# EAGLE schematic atmega2560_3_3v_8mhz (EAGLE 6.1)
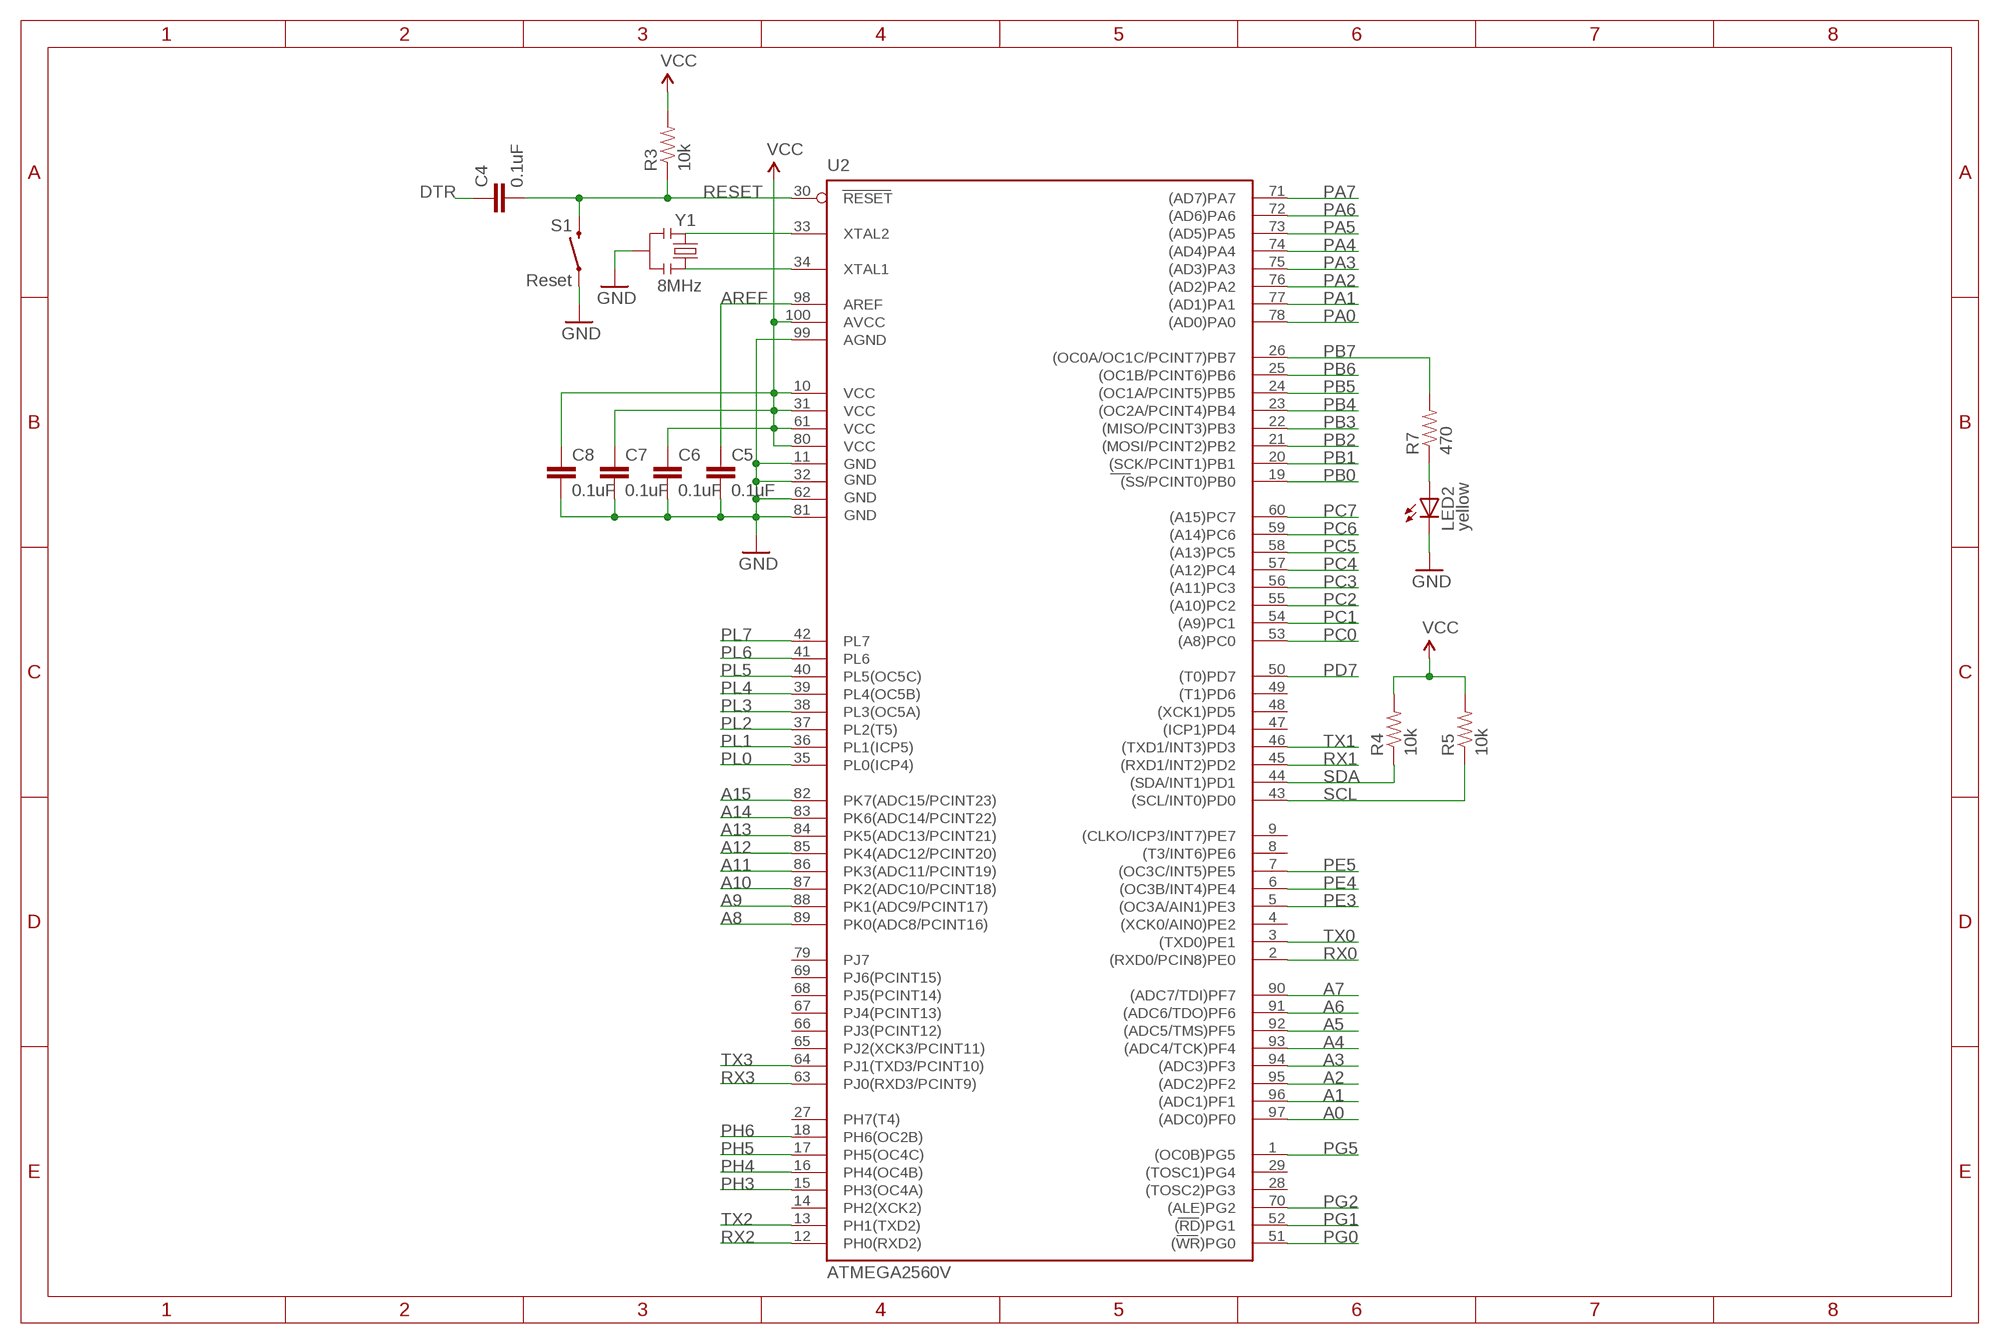
[diagram p0: schematic, sheet 1]

## Parts
C4  0.1uF  CAP0402-CAP  [0402-CAP]
C5  0.1uF  CAP0402-CAP  [0402-CAP]
C6  0.1uF  CAP0402-CAP  [0402-CAP]
C7  0.1uF  CAP0402-CAP  [0402-CAP]
C8  0.1uF  CAP0402-CAP  [0402-CAP]
LED2  yellow  LED0603  [LED-0603]
R3  10k  RESISTOR0402-RES  [0402-RES]
R4  10k  RESISTOR0402-RES  [0402-RES]
R5  10k  RESISTOR0402-RES  [0402-RES]
R7  470  RESISTOR0402-RES  [0402-RES]
S1  SWITCH-MOMENTARY-2SMD  [TACTILE_SWITCH_SMD]
U2  ATMEGA2560AU  [TQFP100]
Y1  RESONATORSMD  [RESONATOR-SMD]

## Nets
A0: U2.97((ADC0)PF0)
A1: U2.96((ADC1)PF1)
A2: U2.95((ADC2)PF2)
A3: U2.94((ADC3)PF3)
A4: U2.93((ADC4/TCK)PF4)
A5: U2.92((ADC5/TMS)PF5)
A6: U2.91((ADC6/TDO)PF6)
A7: U2.90((ADC7/TDI)PF7)
A8: U2.89(PK0(ADC8/PCINT16))
A9: U2.88(PK1(ADC9/PCINT17))
A10: U2.87(PK2(ADC10/PCINT18))
A11: U2.86(PK3(ADC11/PCINT19))
A12: U2.85(PK4(ADC12/PCINT20))
A13: U2.84(PK5(ADC13/PCINT21))
A14: U2.83(PK6(ADC14/PCINT22))
A15: U2.82(PK7(ADC15/PCINT23))
AREF: C5.1 U2.98(AREF)
DTR: C4.1
GND: C5.2 C6.2 C7.2 C8.2 LED2.C S1.1 U2.11(GND) U2.32(GND1) U2.62(GND2) U2.81(GND3) U2.99(AGND) Y1.2
N$3: LED2.A R7.1
N$73: U2.33(XTAL2) Y1.1
N$74: U2.34(XTAL1) Y1.3
PA0: U2.78((AD0)PA0)
PA1: U2.77((AD1)PA1)
PA2: U2.76((AD2)PA2)
PA3: U2.75((AD3)PA3)
PA4: U2.74((AD4)PA4)
PA5: U2.73((AD5)PA5)
PA6: U2.72((AD6)PA6)
PA7: U2.71((AD7)PA7)
PB0: U2.19((SS/PCINT0)PB0)
PB1: U2.20((SCK/PCINT1)PB1)
PB2: U2.21((MOSI/PCINT2)PB2)
PB3: U2.22((MISO/PCINT3)PB3)
PB4: U2.23((OC2A/PCINT4)PB4)
PB5: U2.24((OC1A/PCINT5)PB5)
PB6: U2.25((OC1B/PCINT6)PB6)
PB7: R7.2 U2.26((OC0A/OC1C/PCINT7)PB7)
PC0: U2.53((A8)PC0)
PC1: U2.54((A9)PC1)
PC2: U2.55((A10)PC2)
PC3: U2.56((A11)PC3)
PC4: U2.57((A12)PC4)
PC5: U2.58((A13)PC5)
PC6: U2.59((A14)PC6)
PC7: U2.60((A15)PC7)
PD7: U2.50((T0)PD7)
PE3: U2.5((OC3A/AIN1)PE3)
PE4: U2.6((OC3B/INT4)PE4)
PE5: U2.7((OC3C/INT5)PE5)
PG0: U2.51((WR)PG0)
PG1: U2.52((RD)PG1)
PG2: U2.70((ALE)PG2)
PG5: U2.1((OC0B)PG5)
PH3: U2.15(PH3(OC4A))
PH4: U2.16(PH4(OC4B))
PH5: U2.17(PH5(OC4C))
PH6: U2.18(PH6(OC2B))
PL0: U2.35(PL0(ICP4))
PL1: U2.36(PL1(ICP5))
PL2: U2.37(PL2(T5))
PL3: U2.38(PL3(OC5A))
PL4: U2.39(PL4(OC5B))
PL5: U2.40(PL5(OC5C))
PL6: U2.41(PL6)
PL7: U2.42(PL7)
RESET: C4.2 R3.1 S1.3 U2.30(RESET)
RX0: U2.2((RXD0/PCIN8)PE0)
RX1: U2.45((RXD1/INT2)PD2)
RX2: U2.12(PH0(RXD2))
RX3: U2.63(PJ0(RXD3/PCINT9))
SCL: R5.1 U2.43((SCL/INT0)PD0)
SDA: R4.1 U2.44((SDA/INT1)PD1)
TX0: U2.3((TXD0)PE1)
TX1: U2.46((TXD1/INT3)PD3)
TX2: U2.13(PH1(TXD2))
TX3: U2.64(PJ1(TXD3/PCINT10))
VCC: C6.1 C7.1 C8.1 R3.2 R4.2 R5.2 U2.10(VCC) U2.31(VCC1) U2.61(VCC2) U2.80(VCC3) U2.100(AVCC)
Unconnected: U2.4((XCK0/AIN0)PE2) U2.8((T3/INT6)PE6) U2.9((CLKO/ICP3/INT7)PE7) U2.14(PH2(XCK2)) U2.27(PH7(T4)) U2.28((TOSC2)PG3) U2.29((TOSC1)PG4) U2.47((ICP1)PD4) U2.48((XCK1)PD5) U2.49((T1)PD6) U2.65(PJ2(XCK3/PCINT11)) U2.66(PJ3(PCINT12)) U2.67(PJ4(PCINT13)) U2.68(PJ5(PCINT14)) U2.69(PJ6(PCINT15)) U2.79(PJ7)

## Notes on the sheet
- Reset
- 8MHz
- ATMEGA2560V

## Library data of the parts
C4-C8 = SparkFun:CAP: Capacitor Standard 0603 ceramic capacitor, and 0.1" leaded capacitor.
LED2 = SparkFun:LED: LEDs Standard schematic elements and footprints for 5mm, 3mm, 1206, and 0603 sized LEDs. 5mm - Spark Fun Electronics SKU : COM-00529 (and others)
R3-R5 R7 = SparkFun:RESISTOR: Resistor Basic schematic elements and footprints for 0603, 1206, and PTH resistors.
S1 = SparkFun:SWITCH-MOMENTARY-2
U2 = SparkFun:ATMEGA2560: MICROCONTROLLER 64/128/256 Kbytes FLASH 4 Kbytes EEPROM 8 Kbytes SRAM 86 General Purpose I/O pins 12-channels16-bit PWM 4 x Serial USARTs 16-channels 10-bit A/D
Y1 = SparkFun:RESONATOR: Resonator Small SMD resonator. This is the itty bitty 10/20MHz resonators with built in caps. CSTCE10M0G55 and CSTCE20M0V53. Footprint has been reviewed closely but hasn't been tested yet.